# Altium schematic sheet FPGA.SchDoc
size 635 x 381 mm
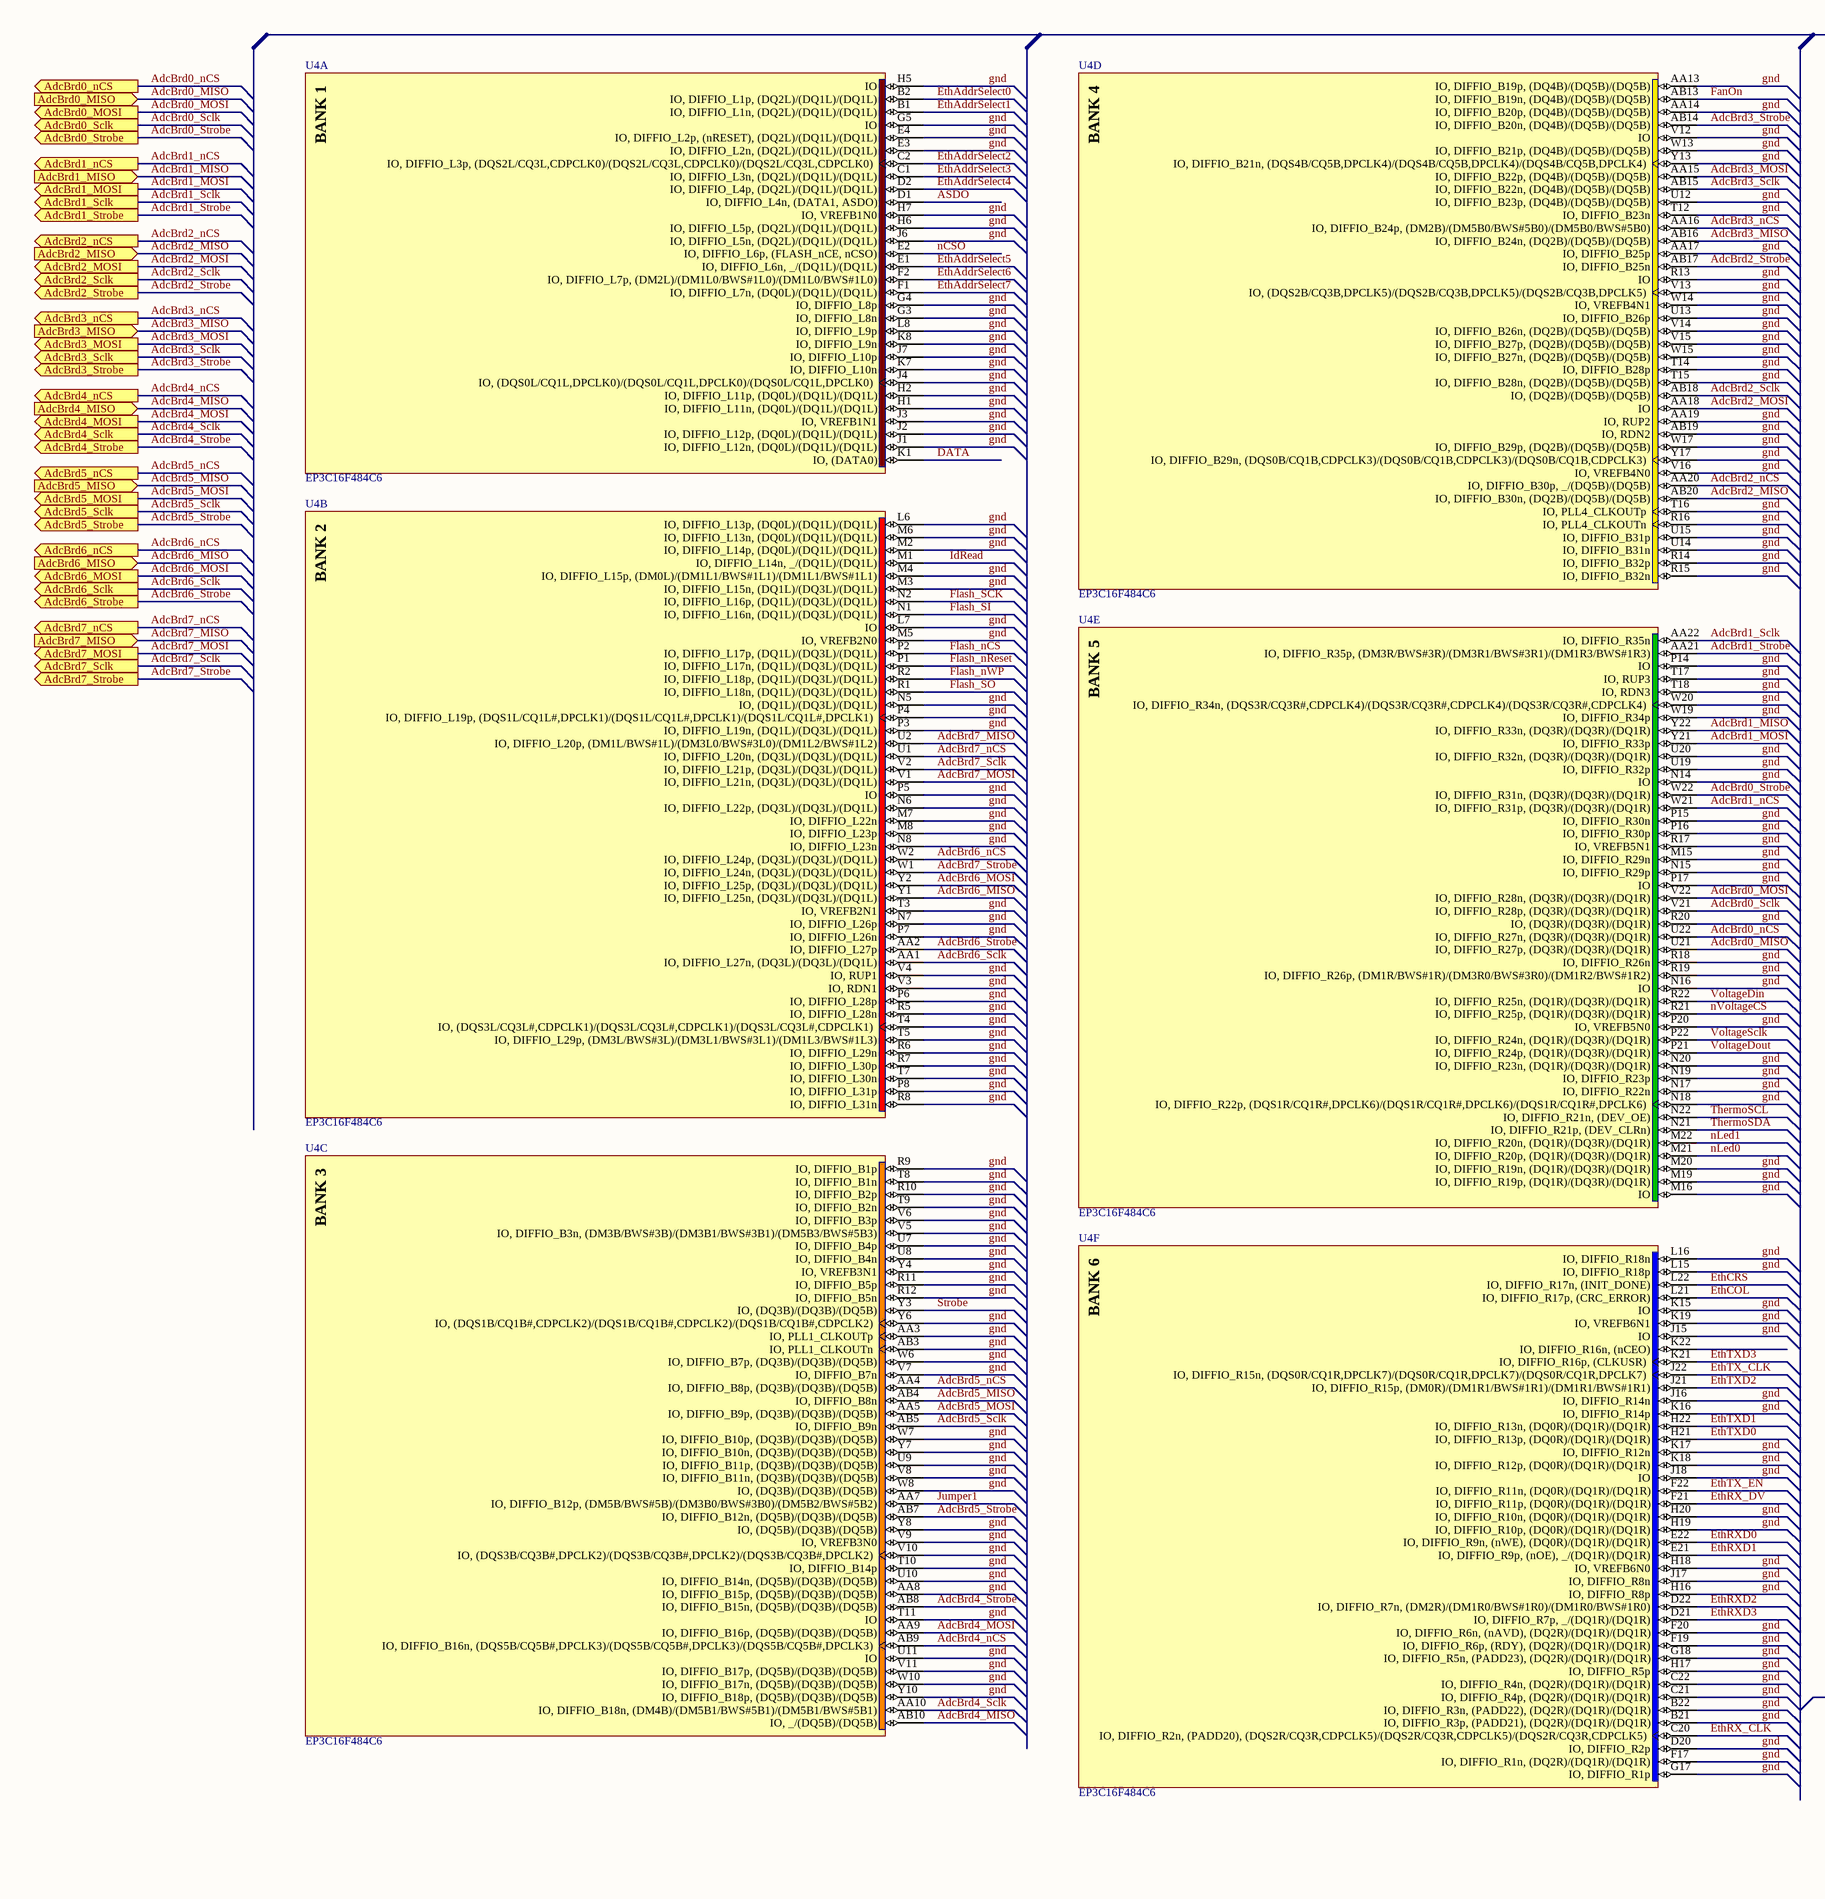
[diagram p0: FPGA.SchDoc, left]
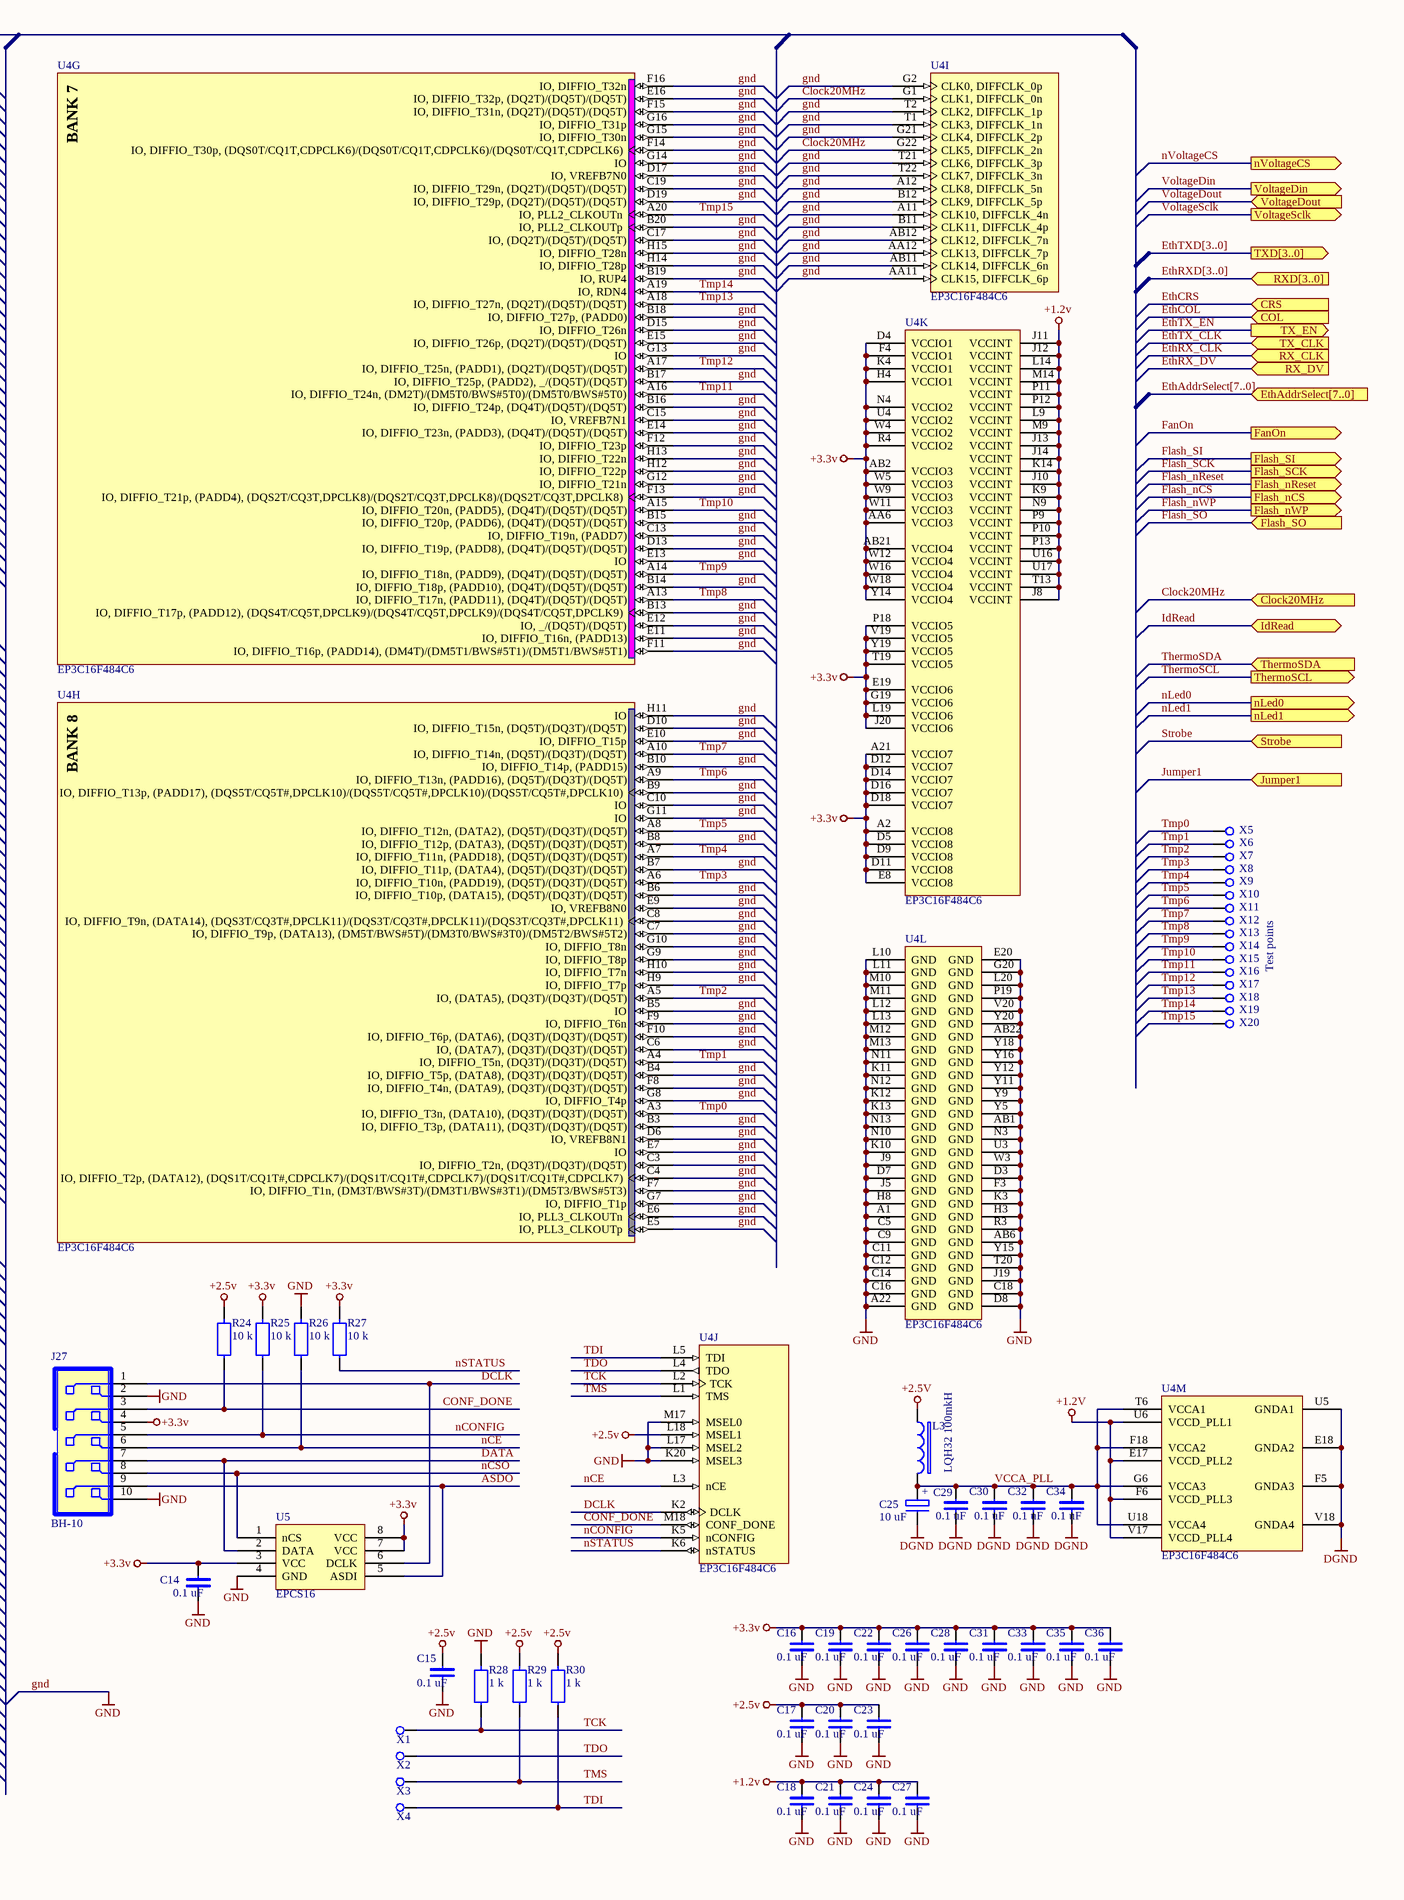
[diagram p1: FPGA.SchDoc, right]

## Parts
C14  0.1 uF  [0603]
C15  0.1 uF  [0603]
C16  0.1 uF  [0603]
C17  0.1 uF  [0603]
C18  0.1 uF  [0603]
C19  0.1 uF  [0603]
C20  0.1 uF  [0603]
C21  0.1 uF  [0603]
C22  0.1 uF  [0603]
C23  0.1 uF  [0603]
C24  0.1 uF  [0603]
C25  10 uF  [CP3216]
C26  0.1 uF  [0603]
C27  0.1 uF  [0603]
C28  0.1 uF  [0603]
C29  0.1 uF  [0603]
C30  0.1 uF  [0603]
C31  0.1 uF  [0603]
C32  0.1 uF  [0603]
C33  0.1 uF  [0603]
C34  0.1 uF  [0603]
C35  0.1 uF  [0603]
C36  0.1 uF  [0603]
J27  BH-10  [BH10]
L3  LQH32 100mkH  [1210]
R24  10 k  [0603]
R25  10 k  [0603]
R26  10 k  [0603]
R27  10 k  [0603]
R28  1 k  [0603]
R29  1 k  [0603]
R30  1 k  [0603]
U4  EP3C16F484C6  [FBGA484-3]  (parts A,B,C,D,E,F,G,H,I,J,K,L,M of 13)
U5  EPCS16  [8SOIC150]
X1  Tmp  [DRL06]  (value not drawn)
X2  Tmp  [DRL06]  (value not drawn)
X3  Tmp  [DRL06]  (value not drawn)
X4  Tmp  [DRL06]  (value not drawn)
X5  Tmp  [DRL06]  (value not drawn)
X6  Tmp  [DRL06]  (value not drawn)
X7  Tmp  [DRL06]  (value not drawn)
X8  Tmp  [DRL06]  (value not drawn)
X9  Tmp  [DRL06]  (value not drawn)
X10  Tmp  [DRL06]  (value not drawn)
X11  Tmp  [DRL06]  (value not drawn)
X12  Tmp  [DRL06]  (value not drawn)
X13  Tmp  [DRL06]  (value not drawn)
X14  Tmp  [DRL06]  (value not drawn)
X15  Tmp  [DRL06]  (value not drawn)
X16  Tmp  [DRL06]  (value not drawn)
X17  Tmp  [DRL06]  (value not drawn)
X18  Tmp  [DRL06]  (value not drawn)
X19  Tmp  [DRL06]  (value not drawn)
X20  Tmp  [DRL06]  (value not drawn)

## Ports
AdcBrd0_MISO (in), AdcBrd0_MOSI (out), AdcBrd0_nCS (out), AdcBrd0_Sclk (out), AdcBrd0_Strobe (out), AdcBrd1_MISO (in), AdcBrd1_MOSI (out), AdcBrd1_nCS (out), AdcBrd1_Sclk (out), AdcBrd1_Strobe (out), AdcBrd2_MISO (in), AdcBrd2_MOSI (out), AdcBrd2_nCS (out), AdcBrd2_Sclk (out), AdcBrd2_Strobe (out), AdcBrd3_MISO (in), AdcBrd3_MOSI (out), AdcBrd3_nCS (out), AdcBrd3_Sclk (out), AdcBrd3_Strobe (out), AdcBrd4_MISO (in), AdcBrd4_MOSI (out), AdcBrd4_nCS (out), AdcBrd4_Sclk (out), AdcBrd4_Strobe (out), AdcBrd5_MISO (in), AdcBrd5_MOSI (out), AdcBrd5_nCS (out), AdcBrd5_Sclk (out), AdcBrd5_Strobe (out), AdcBrd6_MISO (in), AdcBrd6_MOSI (out), AdcBrd6_nCS (out), AdcBrd6_Sclk (out), AdcBrd6_Strobe (out), AdcBrd7_MISO (in), AdcBrd7_MOSI (out), AdcBrd7_nCS (out), AdcBrd7_Sclk (out), AdcBrd7_Strobe (out), Clock20MHz (in), COL (in), CRS (in), EthAddrSelect[7..0] (in), FanOn (out), Flash_nCS (out), Flash_nReset (out), Flash_nWP (out), Flash_SCK (out), Flash_SI (out), Flash_SO (in), IdRead (bidir), Jumper1 (in), nLed0 (out), nLed1 (out), nVoltageCS (out), RX_CLK (in), RX_DV (in), RXD[3..0] (in), Strobe (in), ThermoSCL (out), ThermoSDA (in), TX_CLK (in), TX_EN (out), TXD[3..0] (out), VoltageDin (out), VoltageDout (in), VoltageSclk (out)

## Nets
+1.2V: C18.2 C21.2 C24.2 C27.2 U4.E17(VCCD_PLL2) U4.F6(VCCD_PLL3) U4.J8(VCCINT) U4.J10(VCCINT) U4.J11(VCCINT) U4.J12(VCCINT) U4.J13(VCCINT) U4.J14(VCCINT) U4.K9(VCCINT) U4.K14(VCCINT) U4.L9(VCCINT) U4.L14(VCCINT) U4.M9(VCCINT) U4.M14(VCCINT) U4.N9(VCCINT) U4.P9(VCCINT) U4.P10(VCCINT) U4.P11(VCCINT) U4.P12(VCCINT) U4.P13(VCCINT) U4.T13(VCCINT) U4.U6(VCCD_PLL1) U4.U16(VCCINT) U4.U17(VCCINT) U4.V17(VCCD_PLL4)
+2.5V: C15.2 C17.2 C20.2 C23.2 L3.1 R24.2 R29.2 R30.2 U4.L18(MSEL1)
+3.3v: C14.2 C16.2 C19.2 C22.2 C26.2 C28.2 C31.2 C33.2 C35.2 C36.2 J27.4 R25.2 R27.2 U4.A2(VCCIO8) U4.A21(VCCIO7) U4.AA6(VCCIO3) U4.AB2(VCCIO3) U4.AB21(VCCIO4) U4.D4(VCCIO1) U4.D5(VCCIO8) U4.D9(VCCIO8) U4.D11(VCCIO8) U4.D12(VCCIO7) U4.D14(VCCIO7) U4.D16(VCCIO7) U4.D18(VCCIO7) U4.E8(VCCIO8) U4.E19(VCCIO6) U4.F4(VCCIO1) U4.G19(VCCIO6) U4.H4(VCCIO1) U4.J20(VCCIO6) U4.K4(VCCIO1) U4.L19(VCCIO6) U4.N4(VCCIO2) U4.P18(VCCIO5) U4.R4(VCCIO2) U4.T19(VCCIO5) U4.U4(VCCIO2) U4.V19(VCCIO5) U4.W4(VCCIO2) U4.W5(VCCIO3) U4.W9(VCCIO3) U4.W11(VCCIO3) U4.W12(VCCIO4) U4.W16(VCCIO4) U4.W18(VCCIO4) U4.Y14(VCCIO4) U4.Y19(VCCIO5) U5.3(VCC) U5.7(VCC) U5.8(VCC)
DGND: C25.- C29.1 C30.1 C32.1 C34.1 U4.E18(GNDA2) U4.F5(GNDA3) U4.U5(GNDA1) U4.V18(GNDA4)
gnd: C14.1 C15.1 C16.1 C17.1 C18.1 C19.1 C20.1 C21.1 C22.1 C23.1 C24.1 C26.1 C27.1 C28.1 C31.1 C33.1 C35.1 C36.1 J27.2 J27.10 R26.2 R28.2 U4.A1(GND) U4.A11(CLK10,_DIFFCLK_4n) U4.A12(CLK8,_DIFFCLK_5n) U4.A22(GND) U4.AA3(IO,_PLL1_CLKOUTp) U4.AA8(IO,_DIFFIO_B15p,_(DQ5B)/(DQ3B)/(DQ5B)) U4.AA11(CLK15,_DIFFCLK_6p) U4.AA12(CLK13,_DIFFCLK_7p) U4.AA13(IO,_DIFFIO_B19p,_(DQ4B)/(DQ5B)/(DQ5B)) U4.AA14(IO,_DIFFIO_B20p,_(DQ4B)/(DQ5B)/(DQ5B)) U4.AA17(IO,_DIFFIO_B25p) U4.AA19(IO,_RUP2) U4.AB1(GND) U4.AB3(IO,_PLL1_CLKOUTn) U4.AB6(GND) U4.AB11(CLK14,_DIFFCLK_6n) U4.AB12(CLK12,_DIFFCLK_7n) U4.AB19(IO,_RDN2) U4.AB22(GND) U4.B3(IO,_DIFFIO_T3p,_(DATA11),_(DQ3T)/(DQ3T)/(DQ5T)) U4.B4(IO,_DIFFIO_T5p,_(DATA8),_(DQ3T)/(DQ3T)/(DQ5T)) U4.B5(IO) U4.B6(IO,_DIFFIO_T10p,_(DATA15),_(DQ5T)/(DQ3T)/(DQ5T)) U4.B7(IO,_DIFFIO_T11p,_(DATA4),_(DQ5T)/(DQ3T)/(DQ5T)) U4.B8(IO,_DIFFIO_T12p,_(DATA3),_(DQ5T)/(DQ3T)/(DQ5T)) U4.B9(IO,_DIFFIO_T13p,_(PADD17),_(DQS5T/CQ5T#,DPCLK10)/(DQS5T/CQ5T#,DPCLK10)/(DQS5T/CQ5T#,DPCLK10)) U4.B10(IO,_DIFFIO_T14p,_(PADD15)) U4.B11(CLK11,_DIFFCLK_4p) U4.B12(CLK9,_DIFFCLK_5p) U4.B13(IO,_DIFFIO_T17p,_(PADD12),_(DQS4T/CQ5T,DPCLK9)/(DQS4T/CQ5T,DPCLK9)/(DQS4T/CQ5T,DPCLK9)) U4.B14(IO,_DIFFIO_T18p,_(PADD10),_(DQ4T)/(DQ5T)/(DQ5T)) U4.B15(IO,_DIFFIO_T20p,_(PADD6),_(DQ4T)/(DQ5T)/(DQ5T)) U4.B16(IO,_DIFFIO_T24p,_(DQ4T)/(DQ5T)/(DQ5T)) U4.B17(IO,_DIFFIO_T25p,_(PADD2),__/(DQ5T)/(DQ5T)) U4.B18(IO,_DIFFIO_T27p,_(PADD0)) U4.B19(IO,_RUP4) U4.B20(IO,_PLL2_CLKOUTp) U4.B21(IO,_DIFFIO_R3p,_(PADD21),_(DQ2R)/(DQ1R)/(DQ1R)) U4.B22(IO,_DIFFIO_R3n,_(PADD22),_(DQ2R)/(DQ1R)/(DQ1R)) U4.C3(IO,_DIFFIO_T2n,_(DQ3T)/(DQ3T)/(DQ5T)) U4.C4(IO,_DIFFIO_T2p,_(DATA12),_(DQS1T/CQ1T#,CDPCLK7)/(DQS1T/CQ1T#,CDPCLK7)/(DQS1T/CQ1T#,CDPCLK7)) U4.C5(GND) U4.C6(IO,_(DATA7),_(DQ3T)/(DQ3T)/(DQ5T)) U4.C7(IO,_DIFFIO_T9p,_(DATA13),_(DM5T/BWS#5T)/(DM3T0/BWS#3T0)/(DM5T2/BWS#5T2)) U4.C8(IO,_DIFFIO_T9n,_(DATA14),_(DQS3T/CQ3T#,DPCLK11)/(DQS3T/CQ3T#,DPCLK11)/(DQS3T/CQ3T#,DPCLK11)) U4.C9(GND) U4.C10(IO) U4.C11(GND) U4.C12(GND) U4.C13(IO,_DIFFIO_T19n,_(PADD7)) U4.C14(GND) U4.C15(IO,_VREFB7N1) U4.C16(GND) U4.C17(IO,_(DQ2T)/(DQ5T)/(DQ5T)) U4.C18(GND) U4.C19(IO,_DIFFIO_T29n,_(DQ2T)/(DQ5T)/(DQ5T)) U4.C21(IO,_DIFFIO_R4p,_(DQ2R)/(DQ1R)/(DQ1R)) U4.C22(IO,_DIFFIO_R4n,_(DQ2R)/(DQ1R)/(DQ1R)) U4.D3(GND) U4.D6(IO,_VREFB8N1) U4.D7(GND) U4.D8(GND) U4.D10(IO,_DIFFIO_T15n,_(DQ5T)/(DQ3T)/(DQ5T)) U4.D13(IO,_DIFFIO_T19p,_(PADD8),_(DQ4T)/(DQ5T)/(DQ5T)) U4.D15(IO,_DIFFIO_T26n) U4.D17(IO,_VREFB7N0) U4.D19(IO,_DIFFIO_T29p,_(DQ2T)/(DQ5T)/(DQ5T)) U4.D20(IO,_DIFFIO_R2p) U4.E3(IO,_DIFFIO_L2n,_(DQ2L)/(DQ1L)/(DQ1L)) U4.E4(IO,_DIFFIO_L2p,_(nRESET),_(DQ2L)/(DQ1L)/(DQ1L)) U4.E5(IO,_PLL3_CLKOUTp) U4.E6(IO,_PLL3_CLKOUTn) U4.E7(IO) U4.E9(IO,_VREFB8N0) U4.E10(IO,_DIFFIO_T15p) U4.E11(IO,_DIFFIO_T16n,_(PADD13)) U4.E12(IO,__/(DQ5T)/(DQ5T)) U4.E13(IO) U4.E14(IO,_DIFFIO_T23n,_(PADD3),_(DQ4T)/(DQ5T)/(DQ5T)) U4.E15(IO,_DIFFIO_T26p,_(DQ2T)/(DQ5T)/(DQ5T)) U4.E16(IO,_DIFFIO_T32p,_(DQ2T)/(DQ5T)/(DQ5T)) U4.E20(GND) U4.F3(GND) U4.F7(IO,_DIFFIO_T1n,_(DM3T/BWS#3T)/(DM3T1/BWS#3T1)/(DM5T3/BWS#5T3)) U4.F8(IO,_DIFFIO_T4n,_(DATA9),_(DQ3T)/(DQ3T)/(DQ5T)) U4.F9(IO,_DIFFIO_T6n) U4.F10(IO,_DIFFIO_T6p,_(DATA6),_(DQ3T)/(DQ3T)/(DQ5T)) U4.F11(IO,_DIFFIO_T16p,_(PADD14),_(DM4T)/(DM5T1/BWS#5T1)/(DM5T1/BWS#5T1)) U4.F12(IO,_DIFFIO_T23p) U4.F13(IO,_DIFFIO_T21p,_(PADD4),_(DQS2T/CQ3T,DPCLK8)/(DQS2T/CQ3T,DPCLK8)/(DQS2T/CQ3T,DPCLK8)) U4.F14(IO,_DIFFIO_T30p,_(DQS0T/CQ1T,CDPCLK6)/(DQS0T/CQ1T,CDPCLK6)/(DQS0T/CQ1T,CDPCLK6)) U4.F15(IO,_DIFFIO_T31n,_(DQ2T)/(DQ5T)/(DQ5T)) U4.F16(IO,_DIFFIO_T32n) U4.F17(IO,_DIFFIO_R1n,_(DQ2R)/(DQ1R)/(DQ1R)) U4.F19(IO,_DIFFIO_R6p,_(RDY),_(DQ2R)/(DQ1R)/(DQ1R)) U4.F20(IO,_DIFFIO_R6n,_(nAVD),_(DQ2R)/(DQ1R)/(DQ1R)) U4.G2(CLK0,_DIFFCLK_0p) U4.G3(IO,_DIFFIO_L8n) U4.G4(IO,_DIFFIO_L8p) U4.G5(IO) U4.G7(IO,_DIFFIO_T1p) U4.G8(IO,_DIFFIO_T4p) U4.G9(IO,_DIFFIO_T8p) U4.G10(IO,_DIFFIO_T8n) U4.G11(IO) U4.G12(IO,_DIFFIO_T21n) U4.G13(IO) U4.G14(IO) U4.G15(IO,_DIFFIO_T30n) U4.G16(IO,_DIFFIO_T31p) U4.G17(IO,_DIFFIO_R1p) U4.G18(IO,_DIFFIO_R5n,_(PADD23),_(DQ2R)/(DQ1R)/(DQ1R)) U4.G20(GND) U4.G21(CLK4,_DIFFCLK_2p) U4.H1(IO,_DIFFIO_L11n,_(DQ0L)/(DQ1L)/(DQ1L)) U4.H2(IO,_DIFFIO_L11p,_(DQ0L)/(DQ1L)/(DQ1L)) U4.H3(GND) U4.H5(IO) U4.H6(IO,_DIFFIO_L5p,_(DQ2L)/(DQ1L)/(DQ1L)) U4.H7(IO,_VREFB1N0) U4.H8(GND) U4.H9(IO,_DIFFIO_T7p) U4.H10(IO,_DIFFIO_T7n) U4.H11(IO) U4.H12(IO,_DIFFIO_T22p) U4.H13(IO,_DIFFIO_T22n) U4.H14(IO,_DIFFIO_T28p) U4.H15(IO,_DIFFIO_T28n) U4.H16(IO,_DIFFIO_R8p) U4.H17(IO,_DIFFIO_R5p) U4.H18(IO,_VREFB6N0) U4.H19(IO,_DIFFIO_R10p,_(DQ0R)/(DQ1R)/(DQ1R)) U4.H20(IO,_DIFFIO_R10n,_(DQ0R)/(DQ1R)/(DQ1R)) U4.J1(IO,_DIFFIO_L12n,_(DQ0L)/(DQ1L)/(DQ1L)) U4.J2(IO,_DIFFIO_L12p,_(DQ0L)/(DQ1L)/(DQ1L)) U4.J3(IO,_VREFB1N1) U4.J4(IO,_(DQS0L/CQ1L,DPCLK0)/(DQS0L/CQ1L,DPCLK0)/(DQS0L/CQ1L,DPCLK0)) U4.J5(GND) U4.J6(IO,_DIFFIO_L5n,_(DQ2L)/(DQ1L)/(DQ1L)) U4.J7(IO,_DIFFIO_L10p) U4.J9(GND) U4.J15(IO) U4.J16(IO,_DIFFIO_R14n) U4.J17(IO,_DIFFIO_R8n) U4.J18(IO) U4.J19(GND) U4.K3(GND) U4.K7(IO,_DIFFIO_L10n) U4.K8(IO,_DIFFIO_L9n) U4.K10(GND) U4.K11(GND) U4.K12(GND) U4.K13(GND) U4.K15(IO) U4.K16(IO,_DIFFIO_R14p) U4.K17(IO,_DIFFIO_R12n) U4.K18(IO,_DIFFIO_R12p,_(DQ0R)/(DQ1R)/(DQ1R)) U4.K19(IO,_VREFB6N1) U4.K20(MSEL3) U4.L6(IO,_DIFFIO_L13p,_(DQ0L)/(DQ1L)/(DQ1L)) U4.L7(IO) U4.L8(IO,_DIFFIO_L9p) U4.L10(GND) U4.L11(GND) U4.L12(GND) U4.L13(GND) U4.L15(IO,_DIFFIO_R18p) U4.L16(IO,_DIFFIO_R18n) U4.L17(MSEL2) U4.L20(GND) U4.M2(IO,_DIFFIO_L14p,_(DQ0L)/(DQ1L)/(DQ1L)) U4.M3(IO,_DIFFIO_L15n,_(DQ1L)/(DQ3L)/(DQ1L)) U4.M4(IO,_DIFFIO_L15p,_(DM0L)/(DM1L1/BWS#1L1)/(DM1L1/BWS#1L1)) U4.M5(IO,_VREFB2N0) U4.M6(IO,_DIFFIO_L13n,_(DQ0L)/(DQ1L)/(DQ1L)) U4.M7(IO,_DIFFIO_L22n) U4.M8(IO,_DIFFIO_L23p) U4.M10(GND) U4.M11(GND) U4.M12(GND) U4.M13(GND) U4.M15(IO,_DIFFIO_R29n) U4.M16(IO) U4.M17(MSEL0) U4.M19(IO,_DIFFIO_R19p,_(DQ1R)/(DQ3R)/(DQ1R)) U4.M20(IO,_DIFFIO_R19n,_(DQ1R)/(DQ3R)/(DQ1R)) U4.N3(GND) U4.N5(IO,_(DQ1L)/(DQ3L)/(DQ1L)) U4.N6(IO,_DIFFIO_L22p,_(DQ3L)/(DQ3L)/(DQ1L)) U4.N7(IO,_DIFFIO_L26p) U4.N8(IO,_DIFFIO_L23n) U4.N10(GND) U4.N11(GND) U4.N12(GND) U4.N13(GND) U4.N14(IO) U4.N15(IO,_DIFFIO_R29p) U4.N16(IO) U4.N17(IO,_DIFFIO_R22n) U4.N18(IO,_DIFFIO_R22p,_(DQS1R/CQ1R#,DPCLK6)/(DQS1R/CQ1R#,DPCLK6)/(DQS1R/CQ1R#,DPCLK6)) U4.N19(IO,_DIFFIO_R23p) U4.N20(IO,_DIFFIO_R23n,_(DQ1R)/(DQ3R)/(DQ1R)) U4.P3(IO,_DIFFIO_L19n,_(DQ1L)/(DQ3L)/(DQ1L)) U4.P4(IO,_DIFFIO_L19p,_(DQS1L/CQ1L#,DPCLK1)/(DQS1L/CQ1L#,DPCLK1)/(DQS1L/CQ1L#,DPCLK1)) U4.P5(IO) U4.P6(IO,_DIFFIO_L28p) U4.P7(IO,_DIFFIO_L26n) U4.P8(IO,_DIFFIO_L31p) U4.P14(IO) U4.P15(IO,_DIFFIO_R30n) U4.P16(IO,_DIFFIO_R30p) U4.P17(IO) U4.P19(GND) U4.P20(IO,_VREFB5N0) U4.R3(GND) U4.R5(IO,_DIFFIO_L28n) U4.R6(IO,_DIFFIO_L29n) U4.R7(IO,_DIFFIO_L30p) U4.R8(IO,_DIFFIO_L31n) U4.R9(IO,_DIFFIO_B1p) U4.R10(IO,_DIFFIO_B2p) U4.R11(IO,_DIFFIO_B5p) U4.R12(IO,_DIFFIO_B5n) U4.R13(IO) U4.R14(IO,_DIFFIO_B32p) U4.R15(IO,_DIFFIO_B32n) U4.R16(IO,_PLL4_CLKOUTn) U4.R17(IO,_VREFB5N1) U4.R18(IO,_DIFFIO_R26n) U4.R19(IO,_DIFFIO_R26p,_(DM1R/BWS#1R)/(DM3R0/BWS#3R0)/(DM1R2/BWS#1R2)) U4.R20(IO,_(DQ3R)/(DQ3R)/(DQ1R)) U4.T1(CLK3,_DIFFCLK_1n) U4.T2(CLK2,_DIFFCLK_1p) U4.T3(IO,_VREFB2N1) U4.T4(IO,_(DQS3L/CQ3L#,CDPCLK1)/(DQS3L/CQ3L#,CDPCLK1)/(DQS3L/CQ3L#,CDPCLK1)) U4.T5(IO,_DIFFIO_L29p,_(DM3L/BWS#3L)/(DM3L1/BWS#3L1)/(DM1L3/BWS#1L3)) U4.T7(IO,_DIFFIO_L30n) U4.T8(IO,_DIFFIO_B1n) U4.T9(IO,_DIFFIO_B2n) U4.T10(IO,_DIFFIO_B14p) U4.T11(IO) U4.T12(IO,_DIFFIO_B23n) U4.T14(IO,_DIFFIO_B28p) U4.T15(IO,_DIFFIO_B28n,_(DQ2B)/(DQ5B)/(DQ5B)) U4.T16(IO,_PLL4_CLKOUTp) U4.T17(IO,_RUP3) U4.T18(IO,_RDN3) U4.T20(GND) U4.T21(CLK6,_DIFFCLK_3p) U4.T22(CLK7,_DIFFCLK_3n) U4.U3(GND) U4.U7(IO,_DIFFIO_B4p) U4.U8(IO,_DIFFIO_B4n) U4.U9(IO,_DIFFIO_B11p,_(DQ3B)/(DQ3B)/(DQ5B)) U4.U10(IO,_DIFFIO_B14n,_(DQ5B)/(DQ3B)/(DQ5B)) U4.U11(IO) U4.U12(IO,_DIFFIO_B23p,_(DQ4B)/(DQ5B)/(DQ5B)) U4.U13(IO,_DIFFIO_B26p) U4.U14(IO,_DIFFIO_B31n) U4.U15(IO,_DIFFIO_B31p) U4.U19(IO,_DIFFIO_R32p) U4.U20(IO,_DIFFIO_R32n,_(DQ3R)/(DQ3R)/(DQ1R)) U4.V3(IO,_RDN1) U4.V4(IO,_RUP1) U4.V5(IO,_DIFFIO_B3n,_(DM3B/BWS#3B)/(DM3B1/BWS#3B1)/(DM5B3/BWS#5B3)) U4.V6(IO,_DIFFIO_B3p) U4.V7(IO,_DIFFIO_B7n) U4.V8(IO,_DIFFIO_B11n,_(DQ3B)/(DQ3B)/(DQ5B)) U4.V9(IO,_VREFB3N0) U4.V10(IO,_(DQS3B/CQ3B#,DPCLK2)/(DQS3B/CQ3B#,DPCLK2)/(DQS3B/CQ3B#,DPCLK2)) U4.V11(IO,_DIFFIO_B17p,_(DQ5B)/(DQ3B)/(DQ5B)) U4.V12(IO) U4.V13(IO,_(DQS2B/CQ3B,DPCLK5)/(DQS2B/CQ3B,DPCLK5)/(DQS2B/CQ3B,DPCLK5)) U4.V14(IO,_DIFFIO_B26n,_(DQ2B)/(DQ5B)/(DQ5B)) U4.V15(IO,_DIFFIO_B27p,_(DQ2B)/(DQ5B)/(DQ5B)) U4.V16(IO,_VREFB4N0) U4.V20(GND) U4.W3(GND) U4.W6(IO,_DIFFIO_B7p,_(DQ3B)/(DQ3B)/(DQ5B)) U4.W7(IO,_DIFFIO_B10p,_(DQ3B)/(DQ3B)/(DQ5B)) U4.W8(IO,_(DQ3B)/(DQ3B)/(DQ5B)) U4.W10(IO,_DIFFIO_B17n,_(DQ5B)/(DQ3B)/(DQ5B)) U4.W13(IO,_DIFFIO_B21p,_(DQ4B)/(DQ5B)/(DQ5B)) U4.W14(IO,_VREFB4N1) U4.W15(IO,_DIFFIO_B27n,_(DQ2B)/(DQ5B)/(DQ5B)) U4.W17(IO,_DIFFIO_B29p,_(DQ2B)/(DQ5B)/(DQ5B)) U4.W19(IO,_DIFFIO_R34p) U4.W20(IO,_DIFFIO_R34n,_(DQS3R/CQ3R#,CDPCLK4)/(DQS3R/CQ3R#,CDPCLK4)/(DQS3R/CQ3R#,CDPCLK4)) U4.Y4(IO,_VREFB3N1) U4.Y5(GND) U4.Y6(IO,_(DQS1B/CQ1B#,CDPCLK2)/(DQS1B/CQ1B#,CDPCLK2)/(DQS1B/CQ1B#,CDPCLK2)) U4.Y7(IO,_DIFFIO_B10n,_(DQ3B)/(DQ3B)/(DQ5B)) U4.Y8(IO,_(DQ5B)/(DQ3B)/(DQ5B)) U4.Y9(GND) U4.Y10(IO,_DIFFIO_B18p,_(DQ5B)/(DQ3B)/(DQ5B)) U4.Y11(GND) U4.Y12(GND) U4.Y13(IO,_DIFFIO_B21n,_(DQS4B/CQ5B,DPCLK4)/(DQS4B/CQ5B,DPCLK4)/(DQS4B/CQ5B,DPCLK4)) U4.Y15(GND) U4.Y16(GND) U4.Y17(IO,_DIFFIO_B29n,_(DQS0B/CQ1B,CDPCLK3)/(DQS0B/CQ1B,CDPCLK3)/(DQS0B/CQ1B,CDPCLK3)) U4.Y18(GND) U4.Y20(GND) U5.4(GND)
AdcBrd0_MISO: U4.U21(IO,_DIFFIO_R27p,_(DQ3R)/(DQ3R)/(DQ1R)) ; port AdcBrd0_MISO
AdcBrd0_MOSI: U4.V22(IO,_DIFFIO_R28n,_(DQ3R)/(DQ3R)/(DQ1R)) ; port AdcBrd0_MOSI
AdcBrd0_nCS: U4.U22(IO,_DIFFIO_R27n,_(DQ3R)/(DQ3R)/(DQ1R)) ; port AdcBrd0_nCS
AdcBrd0_Sclk: U4.V21(IO,_DIFFIO_R28p,_(DQ3R)/(DQ3R)/(DQ1R)) ; port AdcBrd0_Sclk
AdcBrd0_Strobe: U4.W22(IO,_DIFFIO_R31n,_(DQ3R)/(DQ3R)/(DQ1R)) ; port AdcBrd0_Strobe
AdcBrd1_MISO: U4.Y22(IO,_DIFFIO_R33n,_(DQ3R)/(DQ3R)/(DQ1R)) ; port AdcBrd1_MISO
AdcBrd1_MOSI: U4.Y21(IO,_DIFFIO_R33p) ; port AdcBrd1_MOSI
AdcBrd1_nCS: U4.W21(IO,_DIFFIO_R31p,_(DQ3R)/(DQ3R)/(DQ1R)) ; port AdcBrd1_nCS
AdcBrd1_Sclk: U4.AA22(IO,_DIFFIO_R35n) ; port AdcBrd1_Sclk
AdcBrd1_Strobe: U4.AA21(IO,_DIFFIO_R35p,_(DM3R/BWS#3R)/(DM3R1/BWS#3R1)/(DM1R3/BWS#1R3)) ; port AdcBrd1_Strobe
AdcBrd2_MISO: U4.AB20(IO,_DIFFIO_B30n,_(DQ2B)/(DQ5B)/(DQ5B)) ; port AdcBrd2_MISO
AdcBrd2_MOSI: U4.AA18(IO) ; port AdcBrd2_MOSI
AdcBrd2_nCS: U4.AA20(IO,_DIFFIO_B30p,__/(DQ5B)/(DQ5B)) ; port AdcBrd2_nCS
AdcBrd2_Sclk: U4.AB18(IO,_(DQ2B)/(DQ5B)/(DQ5B)) ; port AdcBrd2_Sclk
AdcBrd2_Strobe: U4.AB17(IO,_DIFFIO_B25n) ; port AdcBrd2_Strobe
AdcBrd3_MISO: U4.AB16(IO,_DIFFIO_B24n,_(DQ2B)/(DQ5B)/(DQ5B)) ; port AdcBrd3_MISO
AdcBrd3_MOSI: U4.AA15(IO,_DIFFIO_B22p,_(DQ4B)/(DQ5B)/(DQ5B)) ; port AdcBrd3_MOSI
AdcBrd3_nCS: U4.AA16(IO,_DIFFIO_B24p,_(DM2B)/(DM5B0/BWS#5B0)/(DM5B0/BWS#5B0)) ; port AdcBrd3_nCS
AdcBrd3_Sclk: U4.AB15(IO,_DIFFIO_B22n,_(DQ4B)/(DQ5B)/(DQ5B)) ; port AdcBrd3_Sclk
AdcBrd3_Strobe: U4.AB14(IO,_DIFFIO_B20n,_(DQ4B)/(DQ5B)/(DQ5B)) ; port AdcBrd3_Strobe
AdcBrd4_MISO: U4.AB10(IO,__/(DQ5B)/(DQ5B)) ; port AdcBrd4_MISO
AdcBrd4_MOSI: U4.AA9(IO,_DIFFIO_B16p,_(DQ5B)/(DQ3B)/(DQ5B)) ; port AdcBrd4_MOSI
AdcBrd4_nCS: U4.AB9(IO,_DIFFIO_B16n,_(DQS5B/CQ5B#,DPCLK3)/(DQS5B/CQ5B#,DPCLK3)/(DQS5B/CQ5B#,DPCLK3)) ; port AdcBrd4_nCS
AdcBrd4_Sclk: U4.AA10(IO,_DIFFIO_B18n,_(DM4B)/(DM5B1/BWS#5B1)/(DM5B1/BWS#5B1)) ; port AdcBrd4_Sclk
AdcBrd4_Strobe: U4.AB8(IO,_DIFFIO_B15n,_(DQ5B)/(DQ3B)/(DQ5B)) ; port AdcBrd4_Strobe
AdcBrd5_MISO: U4.AB4(IO,_DIFFIO_B8n) ; port AdcBrd5_MISO
AdcBrd5_MOSI: U4.AA5(IO,_DIFFIO_B9p,_(DQ3B)/(DQ3B)/(DQ5B)) ; port AdcBrd5_MOSI
AdcBrd5_nCS: U4.AA4(IO,_DIFFIO_B8p,_(DQ3B)/(DQ3B)/(DQ5B)) ; port AdcBrd5_nCS
AdcBrd5_Sclk: U4.AB5(IO,_DIFFIO_B9n) ; port AdcBrd5_Sclk
AdcBrd5_Strobe: U4.AB7(IO,_DIFFIO_B12n,_(DQ5B)/(DQ3B)/(DQ5B)) ; port AdcBrd5_Strobe
AdcBrd6_MISO: U4.Y1(IO,_DIFFIO_L25n,_(DQ3L)/(DQ3L)/(DQ1L)) ; port AdcBrd6_MISO
AdcBrd6_MOSI: U4.Y2(IO,_DIFFIO_L25p,_(DQ3L)/(DQ3L)/(DQ1L)) ; port AdcBrd6_MOSI
AdcBrd6_nCS: U4.W2(IO,_DIFFIO_L24p,_(DQ3L)/(DQ3L)/(DQ1L)) ; port AdcBrd6_nCS
AdcBrd6_Sclk: U4.AA1(IO,_DIFFIO_L27n,_(DQ3L)/(DQ3L)/(DQ1L)) ; port AdcBrd6_Sclk
AdcBrd6_Strobe: U4.AA2(IO,_DIFFIO_L27p) ; port AdcBrd6_Strobe
AdcBrd7_MISO: U4.U2(IO,_DIFFIO_L20p,_(DM1L/BWS#1L)/(DM3L0/BWS#3L0)/(DM1L2/BWS#1L2)) ; port AdcBrd7_MISO
AdcBrd7_MOSI: U4.V1(IO,_DIFFIO_L21n,_(DQ3L)/(DQ3L)/(DQ1L)) ; port AdcBrd7_MOSI
AdcBrd7_nCS: U4.U1(IO,_DIFFIO_L20n,_(DQ3L)/(DQ3L)/(DQ1L)) ; port AdcBrd7_nCS
AdcBrd7_Sclk: U4.V2(IO,_DIFFIO_L21p,_(DQ3L)/(DQ3L)/(DQ1L)) ; port AdcBrd7_Sclk
AdcBrd7_Strobe: U4.W1(IO,_DIFFIO_L24n,_(DQ3L)/(DQ3L)/(DQ1L)) ; port AdcBrd7_Strobe
ASDO: J27.9 U4.D1(IO,_DIFFIO_L4n,_(DATA1,_ASDO)) U5.5(ASDI)
Clock20MHz: U4.G1(CLK1,_DIFFCLK_0n) U4.G22(CLK5,_DIFFCLK_2n) ; port Clock20MHz
CONF_DONE: J27.3 R24.1 U4.M18(CONF_DONE)
DATA: J27.7 U4.K1(IO,_(DATA0)) U5.2(DATA)
DCLK: J27.1 U4.K2(DCLK) U5.6(DCLK)
EthAddrSelect0: U4.B2(IO,_DIFFIO_L1p,_(DQ2L)/(DQ1L)/(DQ1L))
EthAddrSelect1: U4.B1(IO,_DIFFIO_L1n,_(DQ2L)/(DQ1L)/(DQ1L))
EthAddrSelect2: U4.C2(IO,_DIFFIO_L3p,_(DQS2L/CQ3L,CDPCLK0)/(DQS2L/CQ3L,CDPCLK0)/(DQS2L/CQ3L,CDPCLK0))
EthAddrSelect3: U4.C1(IO,_DIFFIO_L3n,_(DQ2L)/(DQ1L)/(DQ1L))
EthAddrSelect4: U4.D2(IO,_DIFFIO_L4p,_(DQ2L)/(DQ1L)/(DQ1L))
EthAddrSelect5: U4.E1(IO,_DIFFIO_L6n,__/(DQ1L)/(DQ1L))
EthAddrSelect6: U4.F2(IO,_DIFFIO_L7p,_(DM2L)/(DM1L0/BWS#1L0)/(DM1L0/BWS#1L0))
EthAddrSelect7: U4.F1(IO,_DIFFIO_L7n,_(DQ0L)/(DQ1L)/(DQ1L))
EthCOL: U4.L21(IO,_DIFFIO_R17p,_(CRC_ERROR)) ; port COL
EthCRS: U4.L22(IO,_DIFFIO_R17n,_(INIT_DONE)) ; port CRS
EthRX_CLK: U4.C20(IO,_DIFFIO_R2n,_(PADD20),_(DQS2R/CQ3R,CDPCLK5)/(DQS2R/CQ3R,CDPCLK5)/(DQS2R/CQ3R,CDPCLK5)) ; port RX_CLK
EthRX_DV: U4.F21(IO,_DIFFIO_R11p,_(DQ0R)/(DQ1R)/(DQ1R)) ; port RX_DV
EthRXD0: U4.E22(IO,_DIFFIO_R9n,_(nWE),_(DQ0R)/(DQ1R)/(DQ1R))
EthRXD1: U4.E21(IO,_DIFFIO_R9p,_(nOE),__/(DQ1R)/(DQ1R))
EthRXD2: U4.D22(IO,_DIFFIO_R7n,_(DM2R)/(DM1R0/BWS#1R0)/(DM1R0/BWS#1R0))
EthRXD3: U4.D21(IO,_DIFFIO_R7p,__/(DQ1R)/(DQ1R))
EthTX_CLK: U4.J22(IO,_DIFFIO_R15n,_(DQS0R/CQ1R,DPCLK7)/(DQS0R/CQ1R,DPCLK7)/(DQS0R/CQ1R,DPCLK7)) ; port TX_CLK
EthTX_EN: U4.F22(IO,_DIFFIO_R11n,_(DQ0R)/(DQ1R)/(DQ1R)) ; port TX_EN
EthTXD0: U4.H21(IO,_DIFFIO_R13p,_(DQ0R)/(DQ1R)/(DQ1R))
EthTXD1: U4.H22(IO,_DIFFIO_R13n,_(DQ0R)/(DQ1R)/(DQ1R))
EthTXD2: U4.J21(IO,_DIFFIO_R15p,_(DM0R)/(DM1R1/BWS#1R1)/(DM1R1/BWS#1R1))
EthTXD3: U4.K21(IO,_DIFFIO_R16p,_(CLKUSR))
FanOn: U4.AB13(IO,_DIFFIO_B19n,_(DQ4B)/(DQ5B)/(DQ5B)) ; port FanOn
Flash_nCS: U4.P2(IO,_DIFFIO_L17p,_(DQ1L)/(DQ3L)/(DQ1L)) ; port Flash_nCS
Flash_nReset: U4.P1(IO,_DIFFIO_L17n,_(DQ1L)/(DQ3L)/(DQ1L)) ; port Flash_nReset
Flash_nWP: U4.R2(IO,_DIFFIO_L18p,_(DQ1L)/(DQ3L)/(DQ1L)) ; port Flash_nWP
Flash_SCK: U4.N2(IO,_DIFFIO_L16p,_(DQ1L)/(DQ3L)/(DQ1L)) ; port Flash_SCK
Flash_SI: U4.N1(IO,_DIFFIO_L16n,_(DQ1L)/(DQ3L)/(DQ1L)) ; port Flash_SI
Flash_SO: U4.R1(IO,_DIFFIO_L18n,_(DQ1L)/(DQ3L)/(DQ1L)) ; port Flash_SO
IdRead: U4.M1(IO,_DIFFIO_L14n,__/(DQ1L)/(DQ1L)) ; port IdRead
Jumper1: U4.AA7(IO,_DIFFIO_B12p,_(DM5B/BWS#5B)/(DM3B0/BWS#3B0)/(DM5B2/BWS#5B2)) ; port Jumper1
nCE: J27.6 R26.1 U4.L3(nCE)
nCONFIG: J27.5 R25.1 U4.K5(nCONFIG)
nCSO: J27.8 U4.E2(IO,_DIFFIO_L6p,_(FLASH_nCE,_nCSO)) U5.1(nCS)
nLed0: U4.M21(IO,_DIFFIO_R20p,_(DQ1R)/(DQ3R)/(DQ1R)) ; port nLed0
nLed1: U4.M22(IO,_DIFFIO_R20n,_(DQ1R)/(DQ3R)/(DQ1R)) ; port nLed1
nSTATUS: R27.1 U4.K6(nSTATUS)
nVoltageCS: U4.R21(IO,_DIFFIO_R25p,_(DQ1R)/(DQ3R)/(DQ1R)) ; port nVoltageCS
Strobe: U4.Y3(IO,_(DQ3B)/(DQ3B)/(DQ5B)) ; port Strobe
TCK: R28.1 U4.L2(TCK) X1.DRIL
TDI: R30.1 U4.L5(TDI) X4.DRIL
TDO: U4.L4(TDO) X2.DRIL
ThermoSCL: U4.N22(IO,_DIFFIO_R21n,_(DEV_OE)) ; port ThermoSCL
ThermoSDA: U4.N21(IO,_DIFFIO_R21p,_(DEV_CLRn)) ; port ThermoSDA
Tmp0: U4.A3(IO,_DIFFIO_T3n,_(DATA10),_(DQ3T)/(DQ3T)/(DQ5T)) X5.DRIL
Tmp1: U4.A4(IO,_DIFFIO_T5n,_(DQ3T)/(DQ3T)/(DQ5T)) X6.DRIL
Tmp2: U4.A5(IO,_(DATA5),_(DQ3T)/(DQ3T)/(DQ5T)) X7.DRIL
Tmp3: U4.A6(IO,_DIFFIO_T10n,_(PADD19),_(DQ5T)/(DQ3T)/(DQ5T)) X8.DRIL
Tmp4: U4.A7(IO,_DIFFIO_T11n,_(PADD18),_(DQ5T)/(DQ3T)/(DQ5T)) X9.DRIL
Tmp5: U4.A8(IO,_DIFFIO_T12n,_(DATA2),_(DQ5T)/(DQ3T)/(DQ5T)) X10.DRIL
Tmp6: U4.A9(IO,_DIFFIO_T13n,_(PADD16),_(DQ5T)/(DQ3T)/(DQ5T)) X11.DRIL
Tmp7: U4.A10(IO,_DIFFIO_T14n,_(DQ5T)/(DQ3T)/(DQ5T)) X12.DRIL
Tmp8: U4.A13(IO,_DIFFIO_T17n,_(PADD11),_(DQ4T)/(DQ5T)/(DQ5T)) X13.DRIL
Tmp9: U4.A14(IO,_DIFFIO_T18n,_(PADD9),_(DQ4T)/(DQ5T)/(DQ5T)) X14.DRIL
Tmp10: U4.A15(IO,_DIFFIO_T20n,_(PADD5),_(DQ4T)/(DQ5T)/(DQ5T)) X15.DRIL
Tmp11: U4.A16(IO,_DIFFIO_T24n,_(DM2T)/(DM5T0/BWS#5T0)/(DM5T0/BWS#5T0)) X16.DRIL
Tmp12: U4.A17(IO,_DIFFIO_T25n,_(PADD1),_(DQ2T)/(DQ5T)/(DQ5T)) X17.DRIL
Tmp13: U4.A18(IO,_DIFFIO_T27n,_(DQ2T)/(DQ5T)/(DQ5T)) X18.DRIL
Tmp14: U4.A19(IO,_RDN4) X19.DRIL
Tmp15: U4.A20(IO,_PLL2_CLKOUTn) X20.DRIL
TMS: R29.1 U4.L1(TMS) X3.DRIL
VCCA_PLL: C25.+ C29.2 C30.2 C32.2 C34.2 L3.2 U4.F18(VCCA2) U4.G6(VCCA3) U4.T6(VCCA1) U4.U18(VCCA4)
VoltageDin: U4.R22(IO,_DIFFIO_R25n,_(DQ1R)/(DQ3R)/(DQ1R)) ; port VoltageDin
VoltageDout: U4.P21(IO,_DIFFIO_R24p,_(DQ1R)/(DQ3R)/(DQ1R)) ; port VoltageDout
VoltageSclk: U4.P22(IO,_DIFFIO_R24n,_(DQ1R)/(DQ3R)/(DQ1R)) ; port VoltageSclk

Not connected (* = marked no-connect by the designer): U4 K22(IO,_DIFFIO_R16n,_(nCEO))

## Buses and harness runs
bus EthAddrSelect[7..0] = port EthAddrSelect[7..0]
bus EthRXD[3..0] = port RXD[3..0]
bus EthTXD[3..0] = port TXD[3..0]

## Notes on the sheet
- Test points
- (in symbol EP3C16F484C6, part A) BANK 1
- (in symbol EP3C16F484C6, part B) BANK 2
- (in symbol EP3C16F484C6, part C) BANK 3
- (in symbol EP3C16F484C6, part D) BANK 4
- (in symbol EP3C16F484C6, part E) BANK 5
- (in symbol EP3C16F484C6, part F) BANK 6
- (in symbol EP3C16F484C6, part G) BANK 7
- (in symbol EP3C16F484C6, part H) BANK 8

## Library data of the parts
C14-C24 C26-C36 = C
C25 = C POL
L3 = DROSSEL
R24-R30 = R
U4 = EP3C16F484C6: Cyclone III Family FPGA, 346 I/O Pins, 4 PLLs, 484-Pin FBGA, Speed Grade 6, Commercial Grade; Published: 26-Feb-2007; DatasheetVersion: ver2.0, May-2008; PackageVersion: ver15.1, May-2008; PackageReference: FBGA484-3; Publisher: Altium Limited; PackageDescription: 484-Ball FineLine Ball Grid Array (FBGA484) - Option 3 - Wire Bond; Code_JEDEC: MS-034-AAJ-1; ComponentLink1Description: Manufacturer Link; ComponentLink1URL: http://www.altera.com/; ComponentLink2Description: Handbook (7.86MB); ComponentLink2URL: http://www.altera.com/literature/hb/cyc3/cyclone3_handbook.pdf; ComponentLink3Description: Packaging Specification; ComponentLink3URL: http://www.altera.com/literature/ds/dspkg.pdf
U5 = EPCS1: Serial configuration device for Cyclone (Altera)
X1-X20 = DRL